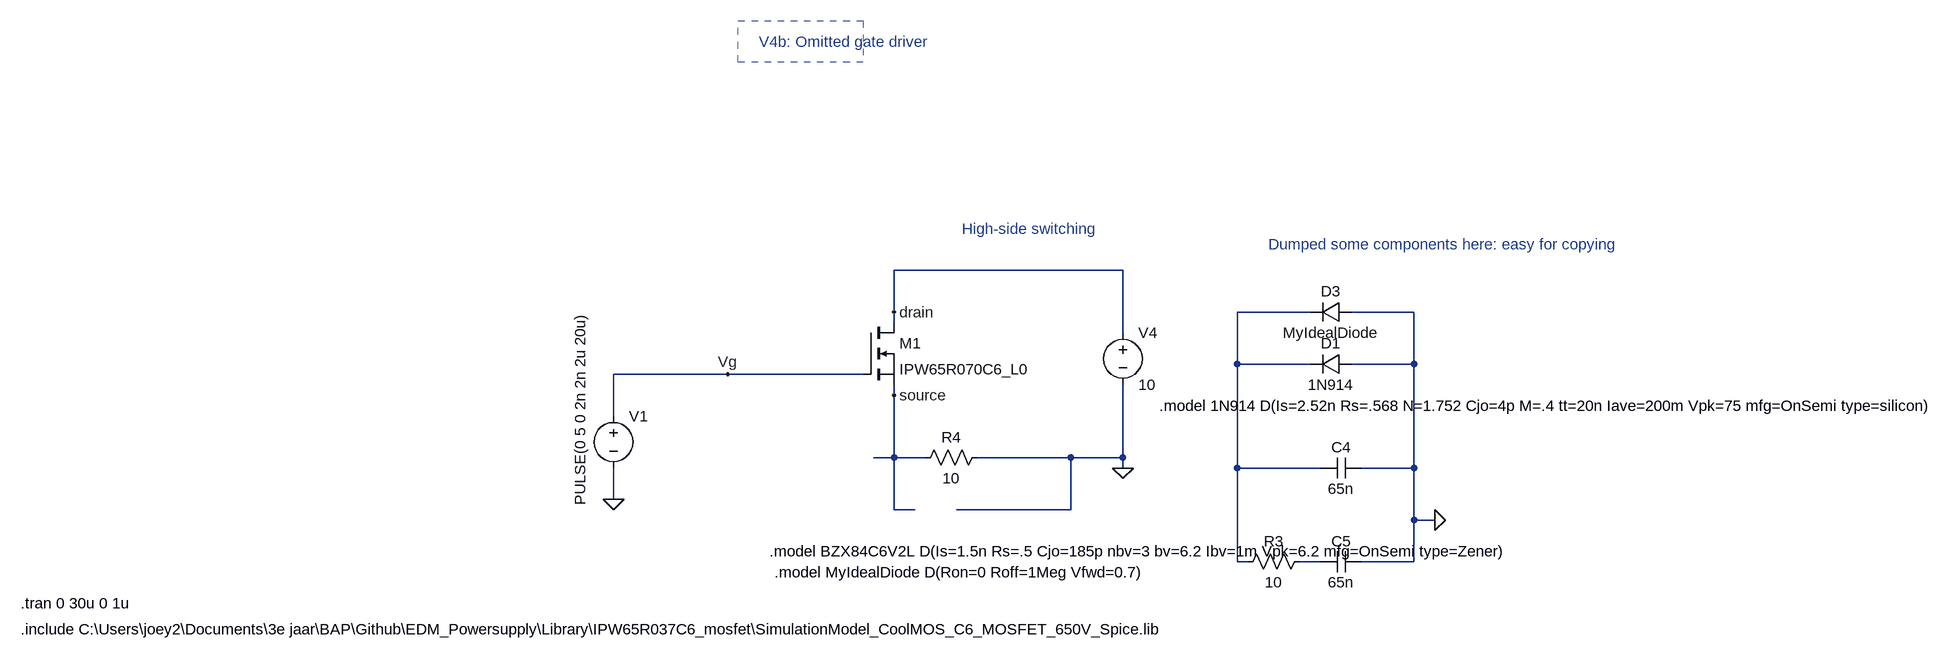
[diagram p0: schematic EDM_Powersupply_V4b_noGD.asc]
EDM_Powersupply_V4b_noGD.asc, the LTspice schematic file:
Version 4
SHEET 1 1876 680
WIRE 976 -32 624 -32
WIRE 624 32 624 -32
WIRE 1264 32 1152 32
WIRE 1424 32 1328 32
WIRE 624 48 624 32
WIRE 976 64 976 -32
WIRE 1152 112 1152 32
WIRE 1264 112 1152 112
WIRE 1424 112 1424 32
WIRE 1424 112 1328 112
WIRE 368 128 192 128
WIRE 576 128 368 128
WIRE 624 160 624 144
WIRE 192 192 192 128
WIRE 624 256 624 160
WIRE 624 256 592 256
WIRE 672 256 624 256
WIRE 896 256 752 256
WIRE 976 256 976 144
WIRE 976 256 896 256
WIRE 976 272 976 256
WIRE 1152 272 1152 112
WIRE 1280 272 1152 272
WIRE 1424 272 1424 112
WIRE 1424 272 1344 272
WIRE 192 320 192 272
WIRE 624 336 624 256
WIRE 656 336 624 336
WIRE 896 336 896 256
WIRE 896 336 720 336
WIRE 1424 352 1424 272
WIRE 1456 352 1424 352
WIRE 1152 416 1152 272
WIRE 1168 416 1152 416
WIRE 1280 416 1248 416
WIRE 1424 416 1424 352
WIRE 1424 416 1344 416
FLAG 192 320 0
FLAG 368 128 Vg
FLAG 624 32 drain
FLAG 624 160 source
FLAG 976 272 0
FLAG 1456 352 0
SYMBOL voltage 192 176 R0
WINDOW 123 0 0 Left 0
WINDOW 39 0 0 Left 0
WINDOW 3 -51 153 VLeft 2
SYMATTR Value PULSE(0 5 0 2n 2n 2u 20u)
SYMATTR InstName V1
SYMBOL res 656 272 R270
WINDOW 0 32 56 VTop 2
WINDOW 3 0 56 VBottom 2
SYMATTR InstName R4
SYMATTR Value 10
SYMBOL voltage 976 48 R0
WINDOW 123 0 0 Left 0
WINDOW 39 0 0 Left 0
SYMATTR InstName V4
SYMATTR Value 10
SYMBOL nmos 576 48 R0
SYMATTR InstName M1
SYMATTR Value IPW65R070C6_L0
SYMATTR Prefix X
SYMBOL cap 1344 256 R90
WINDOW 0 0 32 VBottom 2
WINDOW 3 32 32 VTop 2
SYMATTR InstName C4
SYMATTR Value 65n
SYMBOL diode 1328 96 R90
WINDOW 0 0 32 VBottom 2
WINDOW 3 32 32 VTop 2
SYMATTR InstName D1
SYMATTR Value 1N914
SYMBOL cap 1344 400 R90
WINDOW 0 0 32 VBottom 2
WINDOW 3 32 32 VTop 2
SYMATTR InstName C5
SYMATTR Value 65n
SYMBOL res 1264 400 R90
WINDOW 0 0 56 VBottom 2
WINDOW 3 32 56 VTop 2
SYMATTR InstName R3
SYMATTR Value 10
SYMBOL diode 1328 16 R90
WINDOW 0 0 32 VBottom 2
WINDOW 3 32 32 VTop 2
SYMATTR InstName D3
SYMATTR Value MyIdealDiode
TEXT -720 520 Left 2 !.include C:\\Users\\joey2\\Documents\\3e jaar\\BAP\\Github\\EDM_Powersupply\\Library\\IPW65R037C6_mosfet\\SimulationModel_CoolMOS_C6_MOSFET_650V_Spice.lib
TEXT -720 480 Left 2 !.tran 0 30u 0 1u
TEXT 728 -96 Left 2 ;High-side switching
TEXT 1032 176 Left 2 !.model 1N914 D(Is=2.52n Rs=.568 N=1.752 Cjo=4p M=.4 tt=20n Iave=200m Vpk=75 mfg=OnSemi type=silicon)
TEXT 1200 -72 Left 2 ;Dumped some components here: easy for copying
TEXT 432 400 Left 2 !.model BZX84C6V2L D(Is=1.5n Rs=.5 Cjo=185p nbv=3 bv=6.2 Ibv=1m Vpk=6.2 mfg=OnSemi type=Zener)
TEXT 440 432 Left 2 !.model MyIdealDiode D(Ron=0 Roff=1Meg Vfwd=0.7)
TEXT 416 -384 Left 2 ;V4b: Omitted gate driver
RECTANGLE Normal 576 -352 384 -416 2

The netlist it stands for:
* EDM_Powersupply_V4b_noGD.asc
V1 Vg 0 PULSE(0 5 0 2n 2n 2u 20u)
R4 source 0 10
V4 drain 0 10
XM1 drain Vg source IPW65R070C6_L0  ; pins D G S
C4 0 N001 65n
D1 0 N001 1N914
C5 0 N002 65n
R3 N002 N001 10
D3 0 N001 MyIdealDiode
.model D D
.lib standard.dio
.include C:\Users\joey2\Documents\3e jaar\BAP\Github\EDM_Powersupply\Library\IPW65R037C6_mosfet\SimulationModel_CoolMOS_C6_MOSFET_650V_Spice.lib
.tran 0 30u 0 1u
* High-side switching
.model 1N914 D(Is=2.52n Rs=.568 N=1.752 Cjo=4p M=.4 tt=20n Iave=200m Vpk=75 mfg=OnSemi type=silicon)
* Dumped some components here: easy for copying
.model BZX84C6V2L D(Is=1.5n Rs=.5 Cjo=185p nbv=3 bv=6.2 Ibv=1m Vpk=6.2 mfg=OnSemi type=Zener)
.model MyIdealDiode D(Ron=0 Roff=1Meg Vfwd=0.7)
* V4b: Omitted gate driver
.backanno
.end